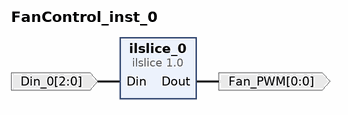
[diagram p0: block diagram of the top level]
# Vivado block design FanControl_inst_0, xck26-sfvc784-2LV-c, Vivado 2025.2
create_bd_design FanControl_inst_0

create_bd_port -dir I -from 2 -to 0 Din_0
create_bd_port -dir O -from 0 -to 0 Fan_PWM

create_bd_cell -type inline_hdl -vlnv xilinx.com:inline_hdl:ilslice:1.0 ilslice_0
set_property -dict {CONFIG.DIN_FROM 2 CONFIG.DIN_TO 2 CONFIG.DIN_WIDTH 3} [get_bd_cells ilslice_0]

# ---- connections ----

connect_bd_net -net Din_0_1 [get_bd_ports Din_0] [get_bd_pins ilslice_0/Din]
connect_bd_net [get_bd_pins ilslice_0/Dout] [get_bd_ports Fan_PWM]

validate_bd_design
save_bd_design
